# Altium schematic sheet STM32G071.SchDoc
size A3
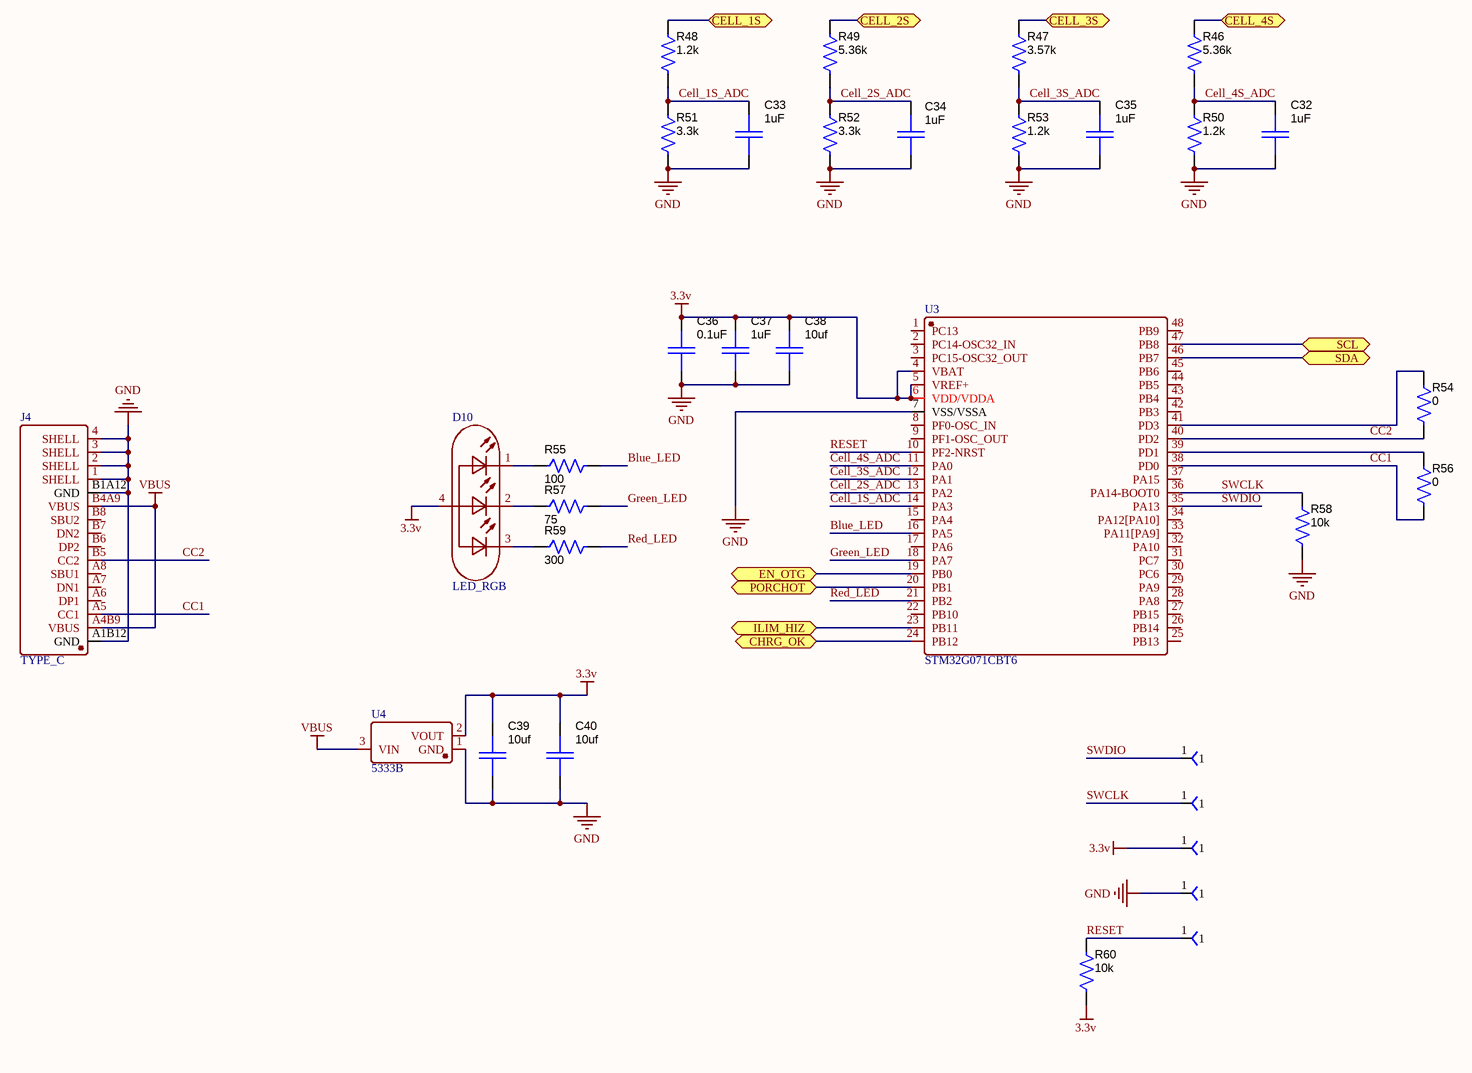
[diagram p0: STM32G071.SchDoc]

## Parts
C32  value 1uF  [C603]  (hidden comment: C0603C104M5RACTU)
C33  value 1uF  [C603]  (hidden comment: C0603C104M5RACTU)
C34  value 1uF  [C603]  (hidden comment: C0603C104M5RACTU)
C35  value 1uF  [C603]  (hidden comment: C0603C104M5RACTU)
C36  value 0.1uF  [C603]  (hidden comment: C0603C104M5RACTU)
C37  value 1uF  [C603]  (hidden comment: C0603C104M5RACTU)
C38  value 10uf  [C603]  (hidden comment: C0603C104M5RACTU)
C39  value 10uf  [C603]  (hidden comment: C0603C104M5RACTU)
C40  value 10uf  [C603]  (hidden comment: C0603C104M5RACTU)
D10  LED_RGB  [LED_RGB]
J4  TYPE_C  [TYPE_C]
R46  value 5.36k  [0603]  (hidden comment: CRCW0603100RJNEAHP)
R47  value 3.57k  [0603]  (hidden comment: CRCW0603100RJNEAHP)
R48  value 1.2k  [0603]  (hidden comment: CRCW0603100RJNEAHP)
R49  value 5.36k  [0603]  (hidden comment: CRCW0603100RJNEAHP)
R50  value 1.2k  [0603]  (hidden comment: CRCW0603100RJNEAHP)
R51  value 3.3k  [0603]  (hidden comment: CRCW0603100RJNEAHP)
R52  value 3.3k  [0603]  (hidden comment: CRCW0603100RJNEAHP)
R53  value 1.2k  [0603]  (hidden comment: CRCW0603100RJNEAHP)
R54  value 0  [0603]  (hidden comment: CRCW0603100RJNEAHP)
R55  value 100  [0603]  (hidden comment: CRCW0603100RJNEAHP)
R56  value 0  [0603]  (hidden comment: CRCW0603100RJNEAHP)
R57  value 75  [0603]  (hidden comment: CRCW0603100RJNEAHP)
R58  value 10k  [0603]  (hidden comment: CRCW0603100RJNEAHP)
R59  value 300  [0603]  (hidden comment: CRCW0603100RJNEAHP)
R60  value 10k  [0603]  (hidden comment: CRCW0603100RJNEAHP)
TP8  TP_40_SMT  [TP_40_SMT]  (value not drawn)  (no BOM)
TP9  TP_40_SMT  [TP_40_SMT]  (value not drawn)  (no BOM)
TP10  TP_40_SMT  [TP_40_SMT]  (value not drawn)  (no BOM)
TP11  TP_40_SMT  [TP_40_SMT]  (value not drawn)  (no BOM)
TP12  TP_40_SMT  [TP_40_SMT]  (value not drawn)  (no BOM)
U3  STM32G071CBT6  [STM32G071CBT6]
U4  5333B  [SOT-23 - duplicate]

## Ports
CELL_1S, CELL_2S, CELL_3S, CELL_4S, CHRG_OK, EN_OTG, ILIM_HIZ, PORCHOT, SCL, SDA

## Nets
3.3v: C36.1 C37.1 C38.1 C39.1 C40.1 D10.4(+) R60.1 TP10.1 U3.4(VBAT) U3.5(VREF+) U3.6(VDD/VDDA) U4.2(VOUT)
GND: C32.2 C33.2 C34.2 C35.2 C36.2 C37.2 C38.2 C39.2 C40.2 J4.1(SHELL) J4.2(SHELL) J4.3(SHELL) J4.4(SHELL) J4.A1B12(GND) J4.B1A12(GND) R50.2 R51.2 R52.2 R53.2 R58.1 TP11.1 U3.7(VSS/VSSA) U4.1(GND)
VBUS: J4.A4B9(VBUS) J4.B4A9(VBUS) U4.3(VIN)
Blue_LED: R55.2 U3.16(PA5)
CC1: J4.A5(CC1) R56.2 U3.38(PD0)
CC2: J4.B5(CC2) R54.2 U3.40(PD2)
CELL_1S: R48.1 ; port CELL_1S
Cell_1S_ADC: C33.1 R48.2 R51.1 U3.14(PA3)
CELL_2S: R49.1 ; port CELL_2S
Cell_2S_ADC: C34.1 R49.2 R52.1 U3.13(PA2)
CELL_3S: R47.1 ; port CELL_3S
Cell_3S_ADC: C35.1 R47.2 R53.1 U3.12(PA1)
CELL_4S: R46.1 ; port CELL_4S
Cell_4S_ADC: C32.1 R46.2 R50.1 U3.11(PA0)
CHRG_OK: U3.24(PB12) ; port CHRG_OK
EN_OTG: U3.19(PB0) ; port EN_OTG
Green_LED: R57.2 U3.18(PA7)
ILIM_HIZ: U3.23(PB11) ; port ILIM_HIZ
PORCHOT: U3.20(PB1) ; port PORCHOT
Red_LED: R59.2 U3.21(PB2)
RESET: R60.2 TP12.1 U3.10(PF2-NRST)
SCL: U3.47(PB8) ; port SCL
SDA: U3.46(PB7) ; port SDA
SWCLK: R58.2 TP9.1 U3.36(PA14-BOOT0)
SWDIO: TP8.1 U3.35(PA13)
NetD10_1: D10.1(R-) R55.1
NetD10_2: D10.2(G-) R57.1
NetD10_3: D10.3(B-) R59.1
NetR54_1: R54.1 U3.41(PD3)
NetR56_1: R56.1 U3.39(PD1)

Not connected (* = marked no-connect by the designer): J4 A6(DP1) A7(DN1) A8(SBU1) B6(DP2) B7(DN2) B8(SBU2); U3 1(PC13) 2(PC14-OSC32_IN) 3(PC15-OSC32_OUT) 8(PF0-OSC_IN) 9(PF1-OSC_OUT) 15(PA4) 17(PA6) 22(PB10) 25(PB13) 26(PB14) 27(PB15) 28(PA8) 29(PA9) 30(PC6) 31(PC7) 32(PA10) 33(PA11[PA9]) 34(PA12[PA10]) 37(PA15) 42(PB3) 43(PB4) 44(PB5) 45(PB6) 48(PB9)

## Library data of the parts
C32-C40 = C0603: Capacitor, Ceramic Chip, 50V, X7R, ±20%; Manufacturer: Kemet; Area: 5650; ComponentHeight: 0.035 inch; SymbolVersion: 07/31/2009 12:17:27; PartNumber: C0603C104M5RACTU; PackageReference: 603; ComponentLink1Description: AEO Datasheet Link
R46-R60 = R0603_1%: Resistor, Chip, 1/10W, 5%; Manufacturer: Vishay-Dale; Area: 9100; SymbolVersion: 05/06/2011 13:51:33; PackageReference: 603; PartNumber: CRCW0603100RJNEAHP; ComponentLink1Description: AEO Datasheet Link
TP8-TP12 = TP_40_SMT: Test point, 40 mil SMT; Manufacturer: None; Value: None; ComponentHeight: None; SymbolVersion: 07/13/2010 09:50:06; area: *; PackageReference: None; PartNumber: None; ComponentLink1Description: AEO Datasheet Link